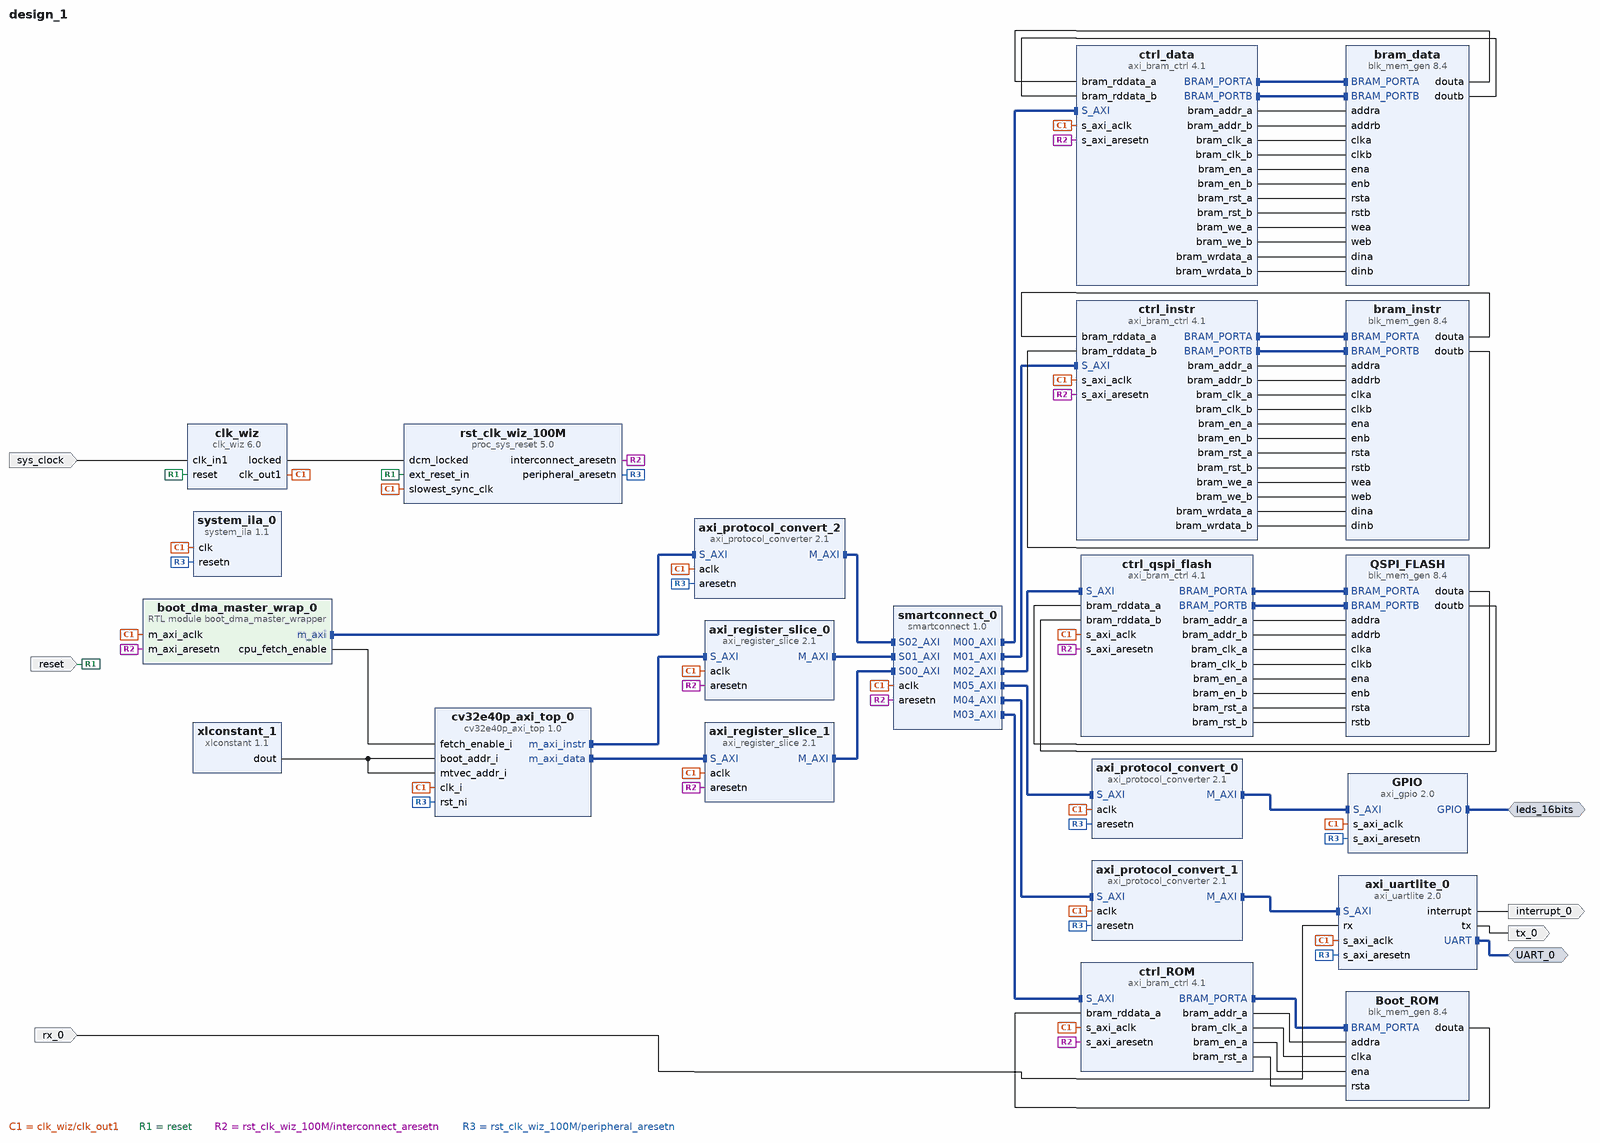
[diagram p0: block diagram of the top level]
# Vivado block design design_1, xc7a35tcpg236-1, Vivado 2022.2
create_bd_design design_1

create_bd_intf_port -mode Master -vlnv xilinx.com:interface:gpio_rtl:1.0 leds_16bits
create_bd_intf_port -mode Master -vlnv xilinx.com:interface:uart_rtl:1.0 UART_0
create_bd_port -dir I -type clk sys_clock
set_property -dict {CONFIG.FREQ_HZ 100000000 CONFIG.PHASE 0.0} [get_bd_ports sys_clock]
create_bd_port -dir I -type rst reset
set_property -dict {CONFIG.POLARITY ACTIVE_HIGH} [get_bd_ports reset]
create_bd_port -dir I rx_0
create_bd_port -dir O tx_0
create_bd_port -dir O -type intr interrupt_0

create_bd_cell -type ip -vlnv xilinx.com:ip:clk_wiz:6.0 clk_wiz
set_property -dict [list \
  CONFIG.CLKOUT1_JITTER 151.636 \
  CONFIG.CLKOUT1_REQUESTED_OUT_FREQ 50.000 \
  CONFIG.CLK_IN1_BOARD_INTERFACE sys_clock \
  CONFIG.MMCM_CLKOUT0_DIVIDE_F 20.000 \
  CONFIG.RESET_BOARD_INTERFACE reset \
  CONFIG.USE_BOARD_FLOW true \
] [get_bd_cells clk_wiz]
create_bd_cell -type ip -vlnv xilinx.com:ip:proc_sys_reset:5.0 rst_clk_wiz_100M
set_property -dict {CONFIG.RESET_BOARD_INTERFACE reset CONFIG.USE_BOARD_FLOW true} [get_bd_cells rst_clk_wiz_100M]
create_bd_cell -type ip -vlnv xilinx.com:ip:xlconstant:1.1 xlconstant_1
set_property -dict {CONFIG.CONST_VAL 0 CONFIG.CONST_WIDTH 32} [get_bd_cells xlconstant_1]
create_bd_cell -type ip -vlnv xilinx.com:user:cv32e40p_axi_top:1.0 cv32e40p_axi_top_0
create_bd_cell -type ip -vlnv xilinx.com:ip:axi_gpio:2.0 GPIO
set_property -dict [list \
  CONFIG.C_ALL_INPUTS 0 \
  CONFIG.C_ALL_OUTPUTS 1 \
  CONFIG.C_GPIO_WIDTH 16 \
  CONFIG.GPIO_BOARD_INTERFACE Custom \
  CONFIG.USE_BOARD_FLOW true \
] [get_bd_cells GPIO]
create_bd_cell -type ip -vlnv xilinx.com:ip:system_ila:1.1 system_ila_0
set_property -dict [list \
  CONFIG.C_MON_TYPE INTERFACE \
  CONFIG.C_NUM_MONITOR_SLOTS 2 \
  CONFIG.C_SLOT_0_APC_EN 0 \
  CONFIG.C_SLOT_0_AXI_AR_SEL_DATA 1 \
  CONFIG.C_SLOT_0_AXI_AR_SEL_TRIG 1 \
  CONFIG.C_SLOT_0_AXI_AW_SEL_DATA 1 \
  CONFIG.C_SLOT_0_AXI_AW_SEL_TRIG 1 \
  CONFIG.C_SLOT_0_AXI_B_SEL_DATA 1 \
  CONFIG.C_SLOT_0_AXI_B_SEL_TRIG 1 \
  CONFIG.C_SLOT_0_AXI_R_SEL_DATA 1 \
  CONFIG.C_SLOT_0_AXI_R_SEL_TRIG 1 \
  CONFIG.C_SLOT_0_AXI_W_SEL_DATA 1 \
  CONFIG.C_SLOT_0_AXI_W_SEL_TRIG 1 \
  CONFIG.C_SLOT_0_INTF_TYPE xilinx.com:interface:aximm_rtl:1.0 \
  CONFIG.C_SLOT_1_APC_EN 0 \
  CONFIG.C_SLOT_1_AXI_AR_SEL_DATA 1 \
  CONFIG.C_SLOT_1_AXI_AR_SEL_TRIG 1 \
  CONFIG.C_SLOT_1_AXI_AW_SEL_DATA 1 \
  CONFIG.C_SLOT_1_AXI_AW_SEL_TRIG 1 \
  CONFIG.C_SLOT_1_AXI_B_SEL_DATA 1 \
  CONFIG.C_SLOT_1_AXI_B_SEL_TRIG 1 \
  CONFIG.C_SLOT_1_AXI_R_SEL_DATA 1 \
  CONFIG.C_SLOT_1_AXI_R_SEL_TRIG 1 \
  CONFIG.C_SLOT_1_AXI_W_SEL_DATA 1 \
  CONFIG.C_SLOT_1_AXI_W_SEL_TRIG 1 \
  CONFIG.C_SLOT_1_INTF_TYPE xilinx.com:interface:aximm_rtl:1.0 \
] [get_bd_cells system_ila_0]
create_bd_cell -type ip -vlnv xilinx.com:ip:axi_bram_ctrl:4.1 ctrl_instr
set_property -dict {CONFIG.PROTOCOL AXI4LITE CONFIG.READ_LATENCY 1 CONFIG.SINGLE_PORT_BRAM 0} [get_bd_cells ctrl_instr]
create_bd_cell -type ip -vlnv xilinx.com:ip:axi_bram_ctrl:4.1 ctrl_data
set_property -dict {CONFIG.PROTOCOL AXI4LITE CONFIG.SINGLE_PORT_BRAM 0} [get_bd_cells ctrl_data]
create_bd_cell -type ip -vlnv xilinx.com:ip:blk_mem_gen:8.4 bram_instr
set_property -dict [list \
  CONFIG.EN_SAFETY_CKT true \
  CONFIG.Memory_Type True_Dual_Port_RAM \
  CONFIG.Operating_Mode_A WRITE_FIRST \
  CONFIG.Write_Width_A 32 \
  CONFIG.use_bram_block BRAM_Controller \
] [get_bd_cells bram_instr]
create_bd_cell -type ip -vlnv xilinx.com:ip:blk_mem_gen:8.4 bram_data
set_property -dict [list \
  CONFIG.Memory_Type True_Dual_Port_RAM \
  CONFIG.Write_Width_A 32 \
  CONFIG.use_bram_block BRAM_Controller \
] [get_bd_cells bram_data]
create_bd_cell -type ip -vlnv xilinx.com:ip:axi_bram_ctrl:4.1 ctrl_ROM
set_property -dict {CONFIG.PROTOCOL AXI4LITE CONFIG.SINGLE_PORT_BRAM 1} [get_bd_cells ctrl_ROM]
create_bd_cell -type ip -vlnv xilinx.com:ip:blk_mem_gen:8.4 Boot_ROM
set_property -dict [list \
  CONFIG.Coe_File ../../../../../../../bootloader.coe \
  CONFIG.Load_Init_File true \
  CONFIG.Memory_Type Single_Port_ROM \
  CONFIG.use_bram_block BRAM_Controller \
] [get_bd_cells Boot_ROM]
create_bd_cell -type ip -vlnv xilinx.com:ip:axi_protocol_converter:2.1 axi_protocol_convert_0
create_bd_cell -type ip -vlnv xilinx.com:ip:axi_uartlite:2.0 axi_uartlite_0
set_property -dict {CONFIG.UARTLITE_BOARD_INTERFACE usb_uart CONFIG.USE_BOARD_FLOW true} [get_bd_cells axi_uartlite_0]
create_bd_cell -type ip -vlnv xilinx.com:ip:axi_protocol_converter:2.1 axi_protocol_convert_1
create_bd_cell -type ip -vlnv xilinx.com:ip:axi_register_slice:2.1 axi_register_slice_0
set_property -dict {CONFIG.REG_AR 1 CONFIG.REG_AW 1 CONFIG.REG_B 1} [get_bd_cells axi_register_slice_0]
create_bd_cell -type ip -vlnv xilinx.com:ip:axi_register_slice:2.1 axi_register_slice_1
set_property -dict {CONFIG.REG_AR 1 CONFIG.REG_AW 1 CONFIG.REG_B 1} [get_bd_cells axi_register_slice_1]
create_bd_cell -type ip -vlnv xilinx.com:ip:axi_bram_ctrl:4.1 ctrl_qspi_flash
set_property -dict {CONFIG.PROTOCOL AXI4LITE} [get_bd_cells ctrl_qspi_flash]
create_bd_cell -type ip -vlnv xilinx.com:ip:blk_mem_gen:8.4 QSPI_FLASH
set_property -dict [list \
  CONFIG.Coe_File ../../../../../../../QSPI_FLASH.coe \
  CONFIG.Load_Init_File true \
  CONFIG.Memory_Type Dual_Port_ROM \
  CONFIG.use_bram_block BRAM_Controller \
] [get_bd_cells QSPI_FLASH]
create_bd_cell -type ip -vlnv xilinx.com:ip:smartconnect:1.0 smartconnect_0
set_property -dict {CONFIG.NUM_MI 6 CONFIG.NUM_SI 3} [get_bd_cells smartconnect_0]
create_bd_cell -type ip -vlnv xilinx.com:ip:axi_protocol_converter:2.1 axi_protocol_convert_2
set_property -dict [list \
  CONFIG.MI_PROTOCOL AXI4 \
  CONFIG.SI_PROTOCOL AXI4LITE \
  CONFIG.TRANSLATION_MODE 2 \
] [get_bd_cells axi_protocol_convert_2]
create_bd_cell -type module -reference boot_dma_master_wrapper boot_dma_master_wrap_0

# ---- connections ----

connect_bd_intf_net -intf_net axi_bram_ctrl_0_BRAM_PORTA [get_bd_intf_pins ctrl_qspi_flash/BRAM_PORTA] [get_bd_intf_pins QSPI_FLASH/BRAM_PORTA]
connect_bd_intf_net -intf_net axi_bram_ctrl_0_BRAM_PORTB [get_bd_intf_pins ctrl_qspi_flash/BRAM_PORTB] [get_bd_intf_pins QSPI_FLASH/BRAM_PORTB]
connect_bd_intf_net -intf_net axi_gpio_0_GPIO [get_bd_intf_ports leds_16bits] [get_bd_intf_pins GPIO/GPIO]
connect_bd_intf_net [get_bd_intf_pins axi_protocol_convert_0/M_AXI] [get_bd_intf_pins GPIO/S_AXI]
connect_bd_intf_net [get_bd_intf_pins axi_protocol_convert_1/M_AXI] [get_bd_intf_pins axi_uartlite_0/S_AXI]
connect_bd_intf_net [get_bd_intf_pins axi_protocol_convert_2/M_AXI] [get_bd_intf_pins smartconnect_0/S02_AXI]
connect_bd_intf_net [get_bd_intf_pins axi_register_slice_0/M_AXI] [get_bd_intf_pins smartconnect_0/S01_AXI]
connect_bd_intf_net [get_bd_intf_pins axi_register_slice_1/M_AXI] [get_bd_intf_pins smartconnect_0/S00_AXI]
connect_bd_intf_net [get_bd_intf_ports UART_0] [get_bd_intf_pins axi_uartlite_0/UART]
connect_bd_intf_net [get_bd_intf_pins boot_dma_master_wrap_0/m_axi] [get_bd_intf_pins axi_protocol_convert_2/S_AXI]
connect_bd_intf_net [get_bd_intf_pins ctrl_ROM/BRAM_PORTA] [get_bd_intf_pins Boot_ROM/BRAM_PORTA]
connect_bd_intf_net [get_bd_intf_pins ctrl_data/BRAM_PORTA] [get_bd_intf_pins bram_data/BRAM_PORTA]
connect_bd_intf_net [get_bd_intf_pins ctrl_data/BRAM_PORTB] [get_bd_intf_pins bram_data/BRAM_PORTB]
connect_bd_intf_net [get_bd_intf_pins ctrl_instr/BRAM_PORTA] [get_bd_intf_pins bram_instr/BRAM_PORTA]
connect_bd_intf_net [get_bd_intf_pins ctrl_instr/BRAM_PORTB] [get_bd_intf_pins bram_instr/BRAM_PORTB]
connect_bd_intf_net [get_bd_intf_pins cv32e40p_axi_top_0/m_axi_data] [get_bd_intf_pins axi_register_slice_1/S_AXI]
connect_bd_intf_net [get_bd_intf_pins cv32e40p_axi_top_0/m_axi_instr] [get_bd_intf_pins axi_register_slice_0/S_AXI]
connect_bd_intf_net [get_bd_intf_pins smartconnect_0/M00_AXI] [get_bd_intf_pins ctrl_data/S_AXI]
connect_bd_intf_net [get_bd_intf_pins smartconnect_0/M01_AXI] [get_bd_intf_pins ctrl_instr/S_AXI]
connect_bd_intf_net [get_bd_intf_pins smartconnect_0/M02_AXI] [get_bd_intf_pins ctrl_qspi_flash/S_AXI]
connect_bd_intf_net [get_bd_intf_pins smartconnect_0/M03_AXI] [get_bd_intf_pins ctrl_ROM/S_AXI]
connect_bd_intf_net [get_bd_intf_pins smartconnect_0/M04_AXI] [get_bd_intf_pins axi_protocol_convert_1/S_AXI]
connect_bd_intf_net [get_bd_intf_pins smartconnect_0/M05_AXI] [get_bd_intf_pins axi_protocol_convert_0/S_AXI]
connect_bd_net [get_bd_pins Boot_ROM/douta] [get_bd_pins ctrl_ROM/bram_rddata_a]
connect_bd_net [get_bd_pins axi_uartlite_0/interrupt] [get_bd_ports interrupt_0]
connect_bd_net [get_bd_pins axi_uartlite_0/tx] [get_bd_ports tx_0]
connect_bd_net -net blk_mem_gen_0_douta [get_bd_pins QSPI_FLASH/douta] [get_bd_pins ctrl_qspi_flash/bram_rddata_a]
connect_bd_net -net blk_mem_gen_0_doutb [get_bd_pins QSPI_FLASH/doutb] [get_bd_pins ctrl_qspi_flash/bram_rddata_b]
connect_bd_net [get_bd_pins boot_dma_master_wrap_0/cpu_fetch_enable] [get_bd_pins cv32e40p_axi_top_0/fetch_enable_i]
connect_bd_net [get_bd_pins bram_data/douta] [get_bd_pins ctrl_data/bram_rddata_a]
connect_bd_net [get_bd_pins bram_data/doutb] [get_bd_pins ctrl_data/bram_rddata_b]
connect_bd_net [get_bd_pins bram_instr/douta] [get_bd_pins ctrl_instr/bram_rddata_a]
connect_bd_net [get_bd_pins bram_instr/doutb] [get_bd_pins ctrl_instr/bram_rddata_b]
connect_bd_net [get_bd_pins clk_wiz/clk_out1] \
  [get_bd_pins rst_clk_wiz_100M/slowest_sync_clk] [get_bd_pins cv32e40p_axi_top_0/clk_i] [get_bd_pins GPIO/s_axi_aclk] \
  [get_bd_pins system_ila_0/clk] [get_bd_pins ctrl_instr/s_axi_aclk] [get_bd_pins ctrl_data/s_axi_aclk] \
  [get_bd_pins ctrl_ROM/s_axi_aclk] [get_bd_pins axi_protocol_convert_0/aclk] [get_bd_pins axi_protocol_convert_1/aclk] \
  [get_bd_pins axi_uartlite_0/s_axi_aclk] [get_bd_pins axi_register_slice_0/aclk] [get_bd_pins axi_register_slice_1/aclk] \
  [get_bd_pins ctrl_qspi_flash/s_axi_aclk] [get_bd_pins smartconnect_0/aclk] [get_bd_pins axi_protocol_convert_2/aclk] \
  [get_bd_pins boot_dma_master_wrap_0/m_axi_aclk]
connect_bd_net [get_bd_pins clk_wiz/locked] [get_bd_pins rst_clk_wiz_100M/dcm_locked]
connect_bd_net [get_bd_pins ctrl_ROM/bram_addr_a] [get_bd_pins Boot_ROM/addra]
connect_bd_net [get_bd_pins ctrl_ROM/bram_clk_a] [get_bd_pins Boot_ROM/clka]
connect_bd_net [get_bd_pins ctrl_ROM/bram_en_a] [get_bd_pins Boot_ROM/ena]
connect_bd_net [get_bd_pins ctrl_ROM/bram_rst_a] [get_bd_pins Boot_ROM/rsta]
connect_bd_net [get_bd_pins ctrl_data/bram_addr_a] [get_bd_pins bram_data/addra]
connect_bd_net [get_bd_pins ctrl_data/bram_addr_b] [get_bd_pins bram_data/addrb]
connect_bd_net [get_bd_pins ctrl_data/bram_clk_a] [get_bd_pins bram_data/clka]
connect_bd_net [get_bd_pins ctrl_data/bram_clk_b] [get_bd_pins bram_data/clkb]
connect_bd_net [get_bd_pins ctrl_data/bram_en_a] [get_bd_pins bram_data/ena]
connect_bd_net [get_bd_pins ctrl_data/bram_en_b] [get_bd_pins bram_data/enb]
connect_bd_net [get_bd_pins ctrl_data/bram_rst_a] [get_bd_pins bram_data/rsta]
connect_bd_net [get_bd_pins ctrl_data/bram_rst_b] [get_bd_pins bram_data/rstb]
connect_bd_net [get_bd_pins ctrl_data/bram_we_a] [get_bd_pins bram_data/wea]
connect_bd_net [get_bd_pins ctrl_data/bram_we_b] [get_bd_pins bram_data/web]
connect_bd_net [get_bd_pins ctrl_data/bram_wrdata_a] [get_bd_pins bram_data/dina]
connect_bd_net [get_bd_pins ctrl_data/bram_wrdata_b] [get_bd_pins bram_data/dinb]
connect_bd_net [get_bd_pins ctrl_instr/bram_addr_a] [get_bd_pins bram_instr/addra]
connect_bd_net [get_bd_pins ctrl_instr/bram_addr_b] [get_bd_pins bram_instr/addrb]
connect_bd_net [get_bd_pins ctrl_instr/bram_clk_a] [get_bd_pins bram_instr/clka]
connect_bd_net [get_bd_pins ctrl_instr/bram_clk_b] [get_bd_pins bram_instr/clkb]
connect_bd_net [get_bd_pins ctrl_instr/bram_en_a] [get_bd_pins bram_instr/ena]
connect_bd_net [get_bd_pins ctrl_instr/bram_en_b] [get_bd_pins bram_instr/enb]
connect_bd_net [get_bd_pins ctrl_instr/bram_rst_a] [get_bd_pins bram_instr/rsta]
connect_bd_net [get_bd_pins ctrl_instr/bram_rst_b] [get_bd_pins bram_instr/rstb]
connect_bd_net [get_bd_pins ctrl_instr/bram_we_a] [get_bd_pins bram_instr/wea]
connect_bd_net [get_bd_pins ctrl_instr/bram_we_b] [get_bd_pins bram_instr/web]
connect_bd_net [get_bd_pins ctrl_instr/bram_wrdata_a] [get_bd_pins bram_instr/dina]
connect_bd_net [get_bd_pins ctrl_instr/bram_wrdata_b] [get_bd_pins bram_instr/dinb]
connect_bd_net [get_bd_pins ctrl_qspi_flash/bram_addr_a] [get_bd_pins QSPI_FLASH/addra]
connect_bd_net [get_bd_pins ctrl_qspi_flash/bram_addr_b] [get_bd_pins QSPI_FLASH/addrb]
connect_bd_net [get_bd_pins ctrl_qspi_flash/bram_clk_a] [get_bd_pins QSPI_FLASH/clka]
connect_bd_net [get_bd_pins ctrl_qspi_flash/bram_clk_b] [get_bd_pins QSPI_FLASH/clkb]
connect_bd_net [get_bd_pins ctrl_qspi_flash/bram_en_a] [get_bd_pins QSPI_FLASH/ena]
connect_bd_net [get_bd_pins ctrl_qspi_flash/bram_en_b] [get_bd_pins QSPI_FLASH/enb]
connect_bd_net [get_bd_pins ctrl_qspi_flash/bram_rst_a] [get_bd_pins QSPI_FLASH/rsta]
connect_bd_net [get_bd_pins ctrl_qspi_flash/bram_rst_b] [get_bd_pins QSPI_FLASH/rstb]
connect_bd_net [get_bd_ports reset] [get_bd_pins clk_wiz/reset] [get_bd_pins rst_clk_wiz_100M/ext_reset_in]
connect_bd_net [get_bd_pins rst_clk_wiz_100M/interconnect_aresetn] \
  [get_bd_pins ctrl_data/s_axi_aresetn] [get_bd_pins ctrl_instr/s_axi_aresetn] [get_bd_pins ctrl_ROM/s_axi_aresetn] \
  [get_bd_pins axi_register_slice_1/aresetn] [get_bd_pins axi_register_slice_0/aresetn] \
  [get_bd_pins ctrl_qspi_flash/s_axi_aresetn] [get_bd_pins smartconnect_0/aresetn] \
  [get_bd_pins boot_dma_master_wrap_0/m_axi_aresetn]
connect_bd_net [get_bd_pins rst_clk_wiz_100M/peripheral_aresetn] \
  [get_bd_pins cv32e40p_axi_top_0/rst_ni] [get_bd_pins GPIO/s_axi_aresetn] [get_bd_pins system_ila_0/resetn] \
  [get_bd_pins axi_protocol_convert_0/aresetn] [get_bd_pins axi_protocol_convert_1/aresetn] \
  [get_bd_pins axi_uartlite_0/s_axi_aresetn] [get_bd_pins axi_protocol_convert_2/aresetn]
connect_bd_net -net rx_0_1 [get_bd_ports rx_0] [get_bd_pins axi_uartlite_0/rx]
connect_bd_net [get_bd_ports sys_clock] [get_bd_pins clk_wiz/clk_in1]
connect_bd_net [get_bd_pins xlconstant_1/dout] [get_bd_pins cv32e40p_axi_top_0/boot_addr_i] [get_bd_pins cv32e40p_axi_top_0/mtvec_addr_i]

# ---- address map ----
assign_bd_address -offset 0x00002000 -range 8K -target_address_space [get_bd_addr_spaces boot_dma_master_wrap_0/m_axi] [get_bd_addr_segs ctrl_qspi_flash/S_AXI/Mem0]
assign_bd_address -offset 0x00004000 -range 8K -target_address_space [get_bd_addr_spaces boot_dma_master_wrap_0/m_axi] [get_bd_addr_segs ctrl_instr/S_AXI/Mem0]
assign_bd_address -offset 0x00002000 -range 8K -target_address_space [get_bd_addr_spaces cv32e40p_axi_top_0/m_axi_data] [get_bd_addr_segs ctrl_qspi_flash/S_AXI/Mem0]
assign_bd_address -offset 0x00004000 -range 8K -target_address_space [get_bd_addr_spaces cv32e40p_axi_top_0/m_axi_data] [get_bd_addr_segs ctrl_instr/S_AXI/Mem0]
assign_bd_address -offset 0x00006000 -range 8K -target_address_space [get_bd_addr_spaces cv32e40p_axi_top_0/m_axi_data] [get_bd_addr_segs ctrl_data/S_AXI/Mem0]
assign_bd_address -offset 0x40000000 -range 64K -target_address_space [get_bd_addr_spaces cv32e40p_axi_top_0/m_axi_data] [get_bd_addr_segs GPIO/S_AXI/Reg]
assign_bd_address -offset 0x40010000 -range 64K -target_address_space [get_bd_addr_spaces cv32e40p_axi_top_0/m_axi_data] [get_bd_addr_segs axi_uartlite_0/S_AXI/Reg]
exclude_bd_addr_seg -offset 0x00000000 -range 4K -target_address_space [get_bd_addr_spaces cv32e40p_axi_top_0/m_axi_data] [get_bd_addr_segs ctrl_ROM/S_AXI/Mem0]
assign_bd_address -offset 0x00000000 -range 4K -target_address_space [get_bd_addr_spaces cv32e40p_axi_top_0/m_axi_instr] [get_bd_addr_segs ctrl_ROM/S_AXI/Mem0]
assign_bd_address -offset 0x00004000 -range 8K -target_address_space [get_bd_addr_spaces cv32e40p_axi_top_0/m_axi_instr] [get_bd_addr_segs ctrl_instr/S_AXI/Mem0]
exclude_bd_addr_seg -offset 0x00004000 -range 8K -target_address_space [get_bd_addr_spaces cv32e40p_axi_top_0/m_axi_instr] [get_bd_addr_segs ctrl_data/S_AXI/Mem0]
exclude_bd_addr_seg -offset 0x40000000 -range 64K -target_address_space [get_bd_addr_spaces cv32e40p_axi_top_0/m_axi_instr] [get_bd_addr_segs GPIO/S_AXI/Reg]
exclude_bd_addr_seg -offset 0x40010000 -range 64K -target_address_space [get_bd_addr_spaces cv32e40p_axi_top_0/m_axi_instr] [get_bd_addr_segs axi_uartlite_0/S_AXI/Reg]
exclude_bd_addr_seg -offset 0xC0000000 -range 8K -target_address_space [get_bd_addr_spaces cv32e40p_axi_top_0/m_axi_instr] [get_bd_addr_segs ctrl_qspi_flash/S_AXI/Mem0]

validate_bd_design
save_bd_design
